# Altium schematic sheet can.SchDoc
size A4; Organization: UNSW Solar Racing Team; Address3: UNSW; Address4: Sydney NSW 2052; Address2: Electrical Engineering; Address1: Room 342
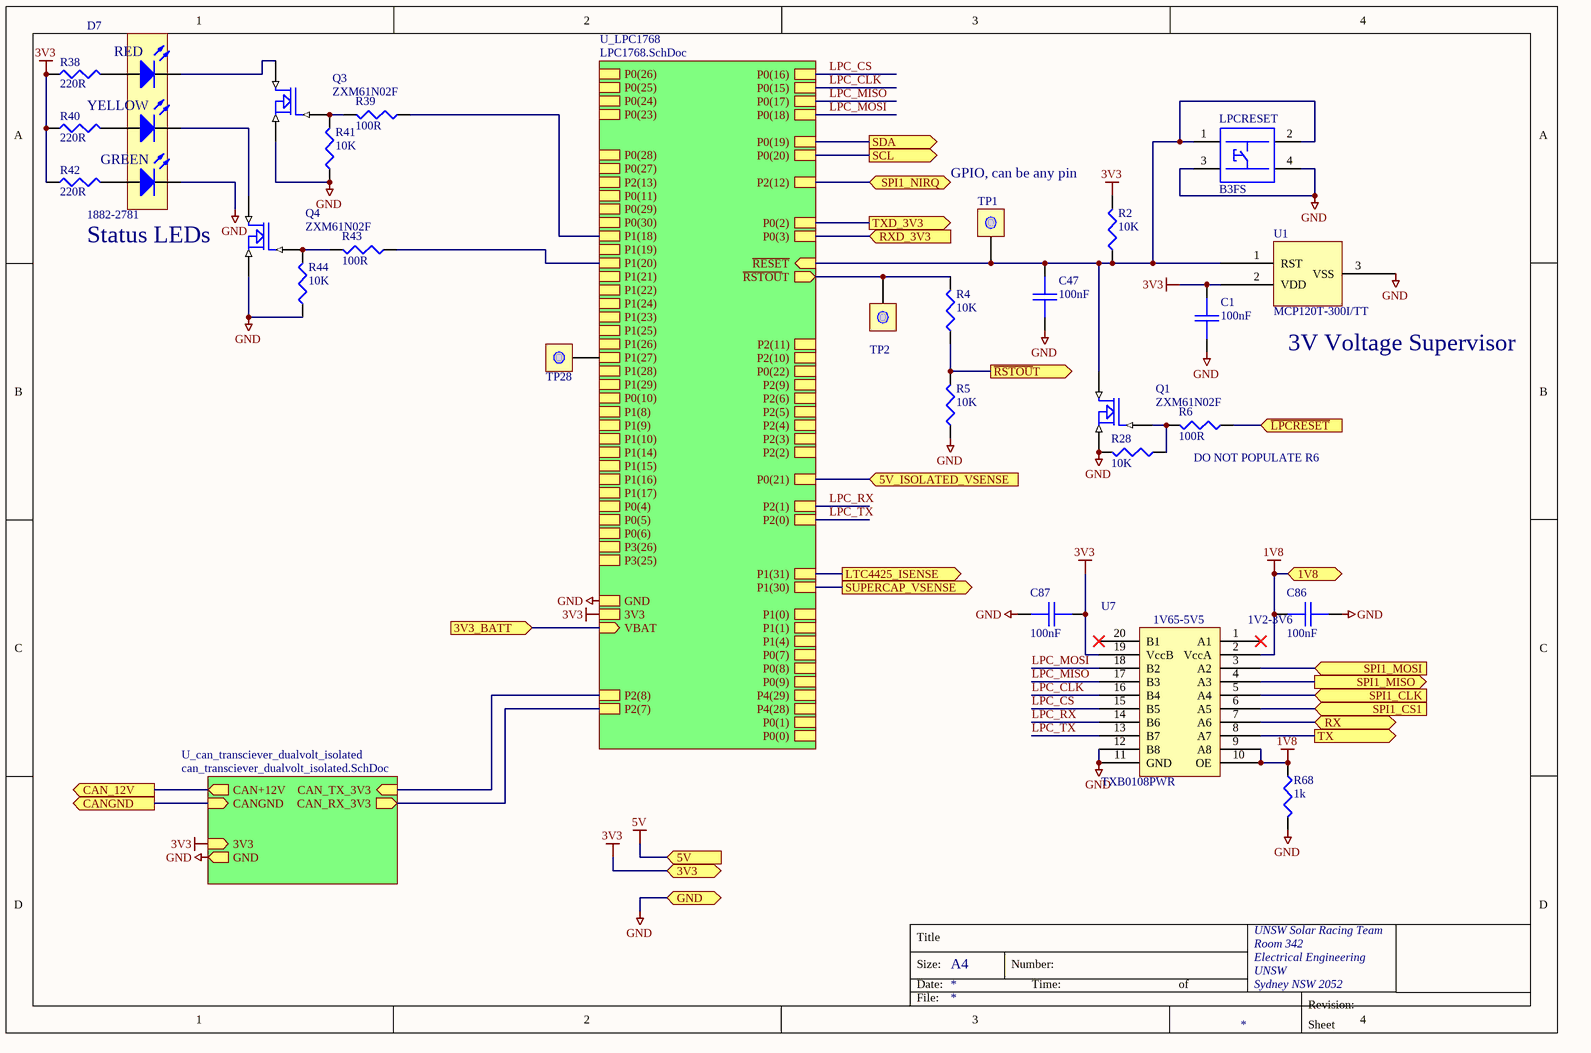
[diagram p0: can.SchDoc]

## Parts
C1  100nF  [0603]
C47  100nF  [0603]
C86  100nF  [0603]
C87  100nF  [0603]
D7  1882-2781  [LED_TRILEVEL]
LPCRESET  B3FS  [B3FS-1052]
Q1  ZXM61N02F  [SOT23-3]
Q3  ZXM61N02F  [SOT23-3]
Q4  ZXM61N02F  [SOT23-3]
R2  10K  [0603]
R4  10K  [0603]
R5  10K  [0603]
R6  100R  [0603]
R28  10K  [0603]
R38  220R  [0603]
R39  100R  [0603]
R40  220R  [0603]
R41  10K  [0603]
R42  220R  [0603]
R43  100R  [0603]
R44  10K  [0603]
R68  1k  [0603]
TP1  RESET  [TESTPOINT]  (value not drawn)
TP2  RSTOUT  [TESTPOINT]  (value not drawn)
TP28  CLKOUT  [TESTPOINT]  (value not drawn)
U1  MCP120T-300I/TT  [SOT23-3]
U7  TXB0108PWR  [TSSOP20]

## Sub-sheets
U_can_transciever_dualvolt_isolated = can_transciever_dualvolt_isolated.SchDoc: CAN+12V (out), CANGND, GND (out), 3V3, CAN_RX_3V3 (out), CAN_TX_3V3 (in)
U_LPC1768 = LPC1768.SchDoc: P0(26), P0(25), P0(24), P0(23), P1(31), P1(30), P0(28), P0(27), P3(26), P3(25), P0(29), P0(30), P1(18), P1(19), P1(20), P1(21), P1(22), P1(24), P1(23), P1(25), P1(26), P1(27), P1(28), P1(29), P0(0), P0(1), P0(10), P0(11), P2(13), P2(12), P2(11), P2(10), P0(22), P0(21), P0(20), P0(19), P0(18), P0(17), P0(15), P0(16), P2(9), P2(8), P2(7), P2(6), P2(5), P2(4), P2(3), P2(2), P2(1), P2(0), P0(2), P0(3), P1(0), P1(1), P1(4), P1(8), P1(9), P1(10), P1(14), P1(15), P1(16), P1(17), P0(4), P0(5), P0(6), P0(7), P0(8), P0(9), P4(29), P4(28), GND, 3V3, ~{RSTOU}T (out), ~{RESET} (in), VBAT (in)

## Ports
1V8, 3V3, 3V3_BATT (in), 5V (in), 5V_ISOLATED_VSENSE (in), CAN_12V (out), CANGND (out), GND, LTC4425_ISENSE (out), RX, RXD_3V3 (in), SCL (out), SDA (out), SPI1_CLK (in), SPI1_CS1 (in), SPI1_MISO (out), SPI1_MOSI (in), SPI1_NIRQ, SUPERCAP_VSENSE (out), TX (out), TXD_3V3 (out), ~{LPCRESET} (in), ~{RSTOU}T (out)

## Nets
1V8: C86.2 R68.2 U7.2(VccA) U7.9(A8) U7.10(OE) ; port 1V8
3V3: C1.1 C87.1 R2.2 R38.1 R40.1 R42.1 U1.2(VDD) U7.19(VccB) ; port 3V3, sheet U_LPC1768/3V3, sheet U_can_transciever_dualvolt_isolated/3V3
5V: port 5V
GND: C1.2 C47.2 C86.1 C87.2 D7.1(K) LPCRESET.3(B2) LPCRESET.4(B1) Q1.2(S) Q3.2(S) Q4.2(S) R5.1 R28.2 R41.1 R44.1 R68.1 U1.3(VSS) U7.11(GND) U7.12(B8) ; port GND, sheet U_LPC1768/GND, sheet U_can_transciever_dualvolt_isolated/GND
3V3_BATT: port 3V3_BATT, sheet U_LPC1768/VBAT
5V_ISOLATED_VSENSE: port 5V_ISOLATED_VSENSE, sheet U_LPC1768/P0(21)
CAN_12V: port CAN_12V, sheet U_can_transciever_dualvolt_isolated/CAN+12V
CANGND: port CANGND, sheet U_can_transciever_dualvolt_isolated/CANGND
~{LPCRESET}: R6.2 ; port ~{LPCRESET}
LPC_CLK: U7.16(B4) ; sheet U_LPC1768/P0(15)
LPC_CS: U7.15(B5) ; sheet U_LPC1768/P0(16)
LPC_MISO: U7.17(B3) ; sheet U_LPC1768/P0(17)
LPC_MOSI: U7.18(B2) ; sheet U_LPC1768/P0(18)
LPC_RX: U7.14(B6) ; sheet U_LPC1768/P2(1)
LPC_TX: U7.13(B7) ; sheet U_LPC1768/P2(0)
LTC4425_ISENSE: port LTC4425_ISENSE, sheet U_LPC1768/P1(31)
~{RSTOU}T: R4.1 R5.2 ; port ~{RSTOU}T
RX: U7.7(A6) ; port RX
RXD_3V3: port RXD_3V3, sheet U_LPC1768/P0(3)
SCL: port SCL, sheet U_LPC1768/P0(20)
SDA: port SDA, sheet U_LPC1768/P0(19)
SPI1_CLK: U7.5(A4) ; port SPI1_CLK
SPI1_CS1: U7.6(A5) ; port SPI1_CS1
SPI1_MISO: U7.4(A3) ; port SPI1_MISO
SPI1_MOSI: U7.3(A2) ; port SPI1_MOSI
SPI1_NIRQ: port SPI1_NIRQ, sheet U_LPC1768/P2(12)
SUPERCAP_VSENSE: port SUPERCAP_VSENSE, sheet U_LPC1768/P1(30)
TX: U7.8(A7) ; port TX
TXD_3V3: port TXD_3V3, sheet U_LPC1768/P0(2)
NetC47_1: C47.1 LPCRESET.1(A1) LPCRESET.2(A2) Q1.3(D) R2.1 TP1.0(TP) U1.1(RST) ; sheet U_LPC1768/~{RESET}
NetD7_2: D7.2(K) Q4.3(D)
NetD7_3: D7.3(K) Q3.3(D)
NetD7_4: D7.4(A) R38.2
NetD7_5: D7.5(A) R40.2
NetD7_6: D7.6(A) R42.2
NetQ1_1: Q1.1(G) R6.1 R28.1
NetQ3_1: Q3.1(G) R39.2 R41.2
NetQ4_1: Q4.1(G) R43.2 R44.2
NetR4_2: R4.2 TP2.0(TP) ; sheet U_LPC1768/~{RSTOU}T
NetR39_1: R39.1 ; sheet U_LPC1768/P1(18)
NetR43_1: R43.1 ; sheet U_LPC1768/P1(20)
NetTP28_0: TP28.0(TP) ; sheet U_LPC1768/P1(27)
(unnamed): sheet U_LPC1768/P2(8), sheet U_can_transciever_dualvolt_isolated/CAN_TX_3V3
(unnamed): sheet U_LPC1768/P2(7), sheet U_can_transciever_dualvolt_isolated/CAN_RX_3V3

Not connected (* = marked no-connect by the designer): U7 1(A1)* 20(B1)*

## Notes on the sheet
- GPIO, can be any pin
- Status LEDs
- (near U1) 3V Voltage Supervisor
- DO NOT POPULATE R6
- Title
- Size:
- Date:
- A4
- Number:
- Time:
- of
- File:
- Revision:
- Sheet
- (in symbol LED-TRILEVEL) RED; YELLOW; GREEN
- (in symbol TXB0108PWR) 1V65-5V5; 1V2-3V6

## Library data of the parts
C1 C47 C86 C87 = CAP: Capacitor
D7 = LED-TRILEVEL: Three level LED; Farnell: 1461596; Digikey: 350-1751-ND; DigikeyPrice: 3.22; FarnellPrice: 4.56
LPCRESET = B3FS: SMD tactile switch; Farnell: 3121197; OMRON: B3FS-1052; Digikey: SW792-ND
Q1 Q3 Q4 = ZXM61N02F: 1.7A, 20V N-Channel Enhancement mode FET; Digikey: ZXM61N02FCT-ND; DigikeyPrice: 0.66; Farnell: 9525270; FarnellPrice: 1.35
R2 R4 R5 R28 R38-R44 = RES1: Resistor; Order#: 9331697; Supplier: Farnell; Price: 0.05
R6 R68 = RES1: Resistor
TP1 TP2 TP28 = TEST: TEST POINT
U1 = MCP120T: Voltage Supervisor; Farnell: 1292233; FarnellPrice: 0.951; Digikey: MCP120T-300I/TTCT-ND; DigikeyPrice: 0.54
U7 = TXB0108PWR: 4 bit bidirectional auto direction sense level translator; Digikey: 296-21527-1-ND